# Altium project Load_Bank_Master.PrjPcb
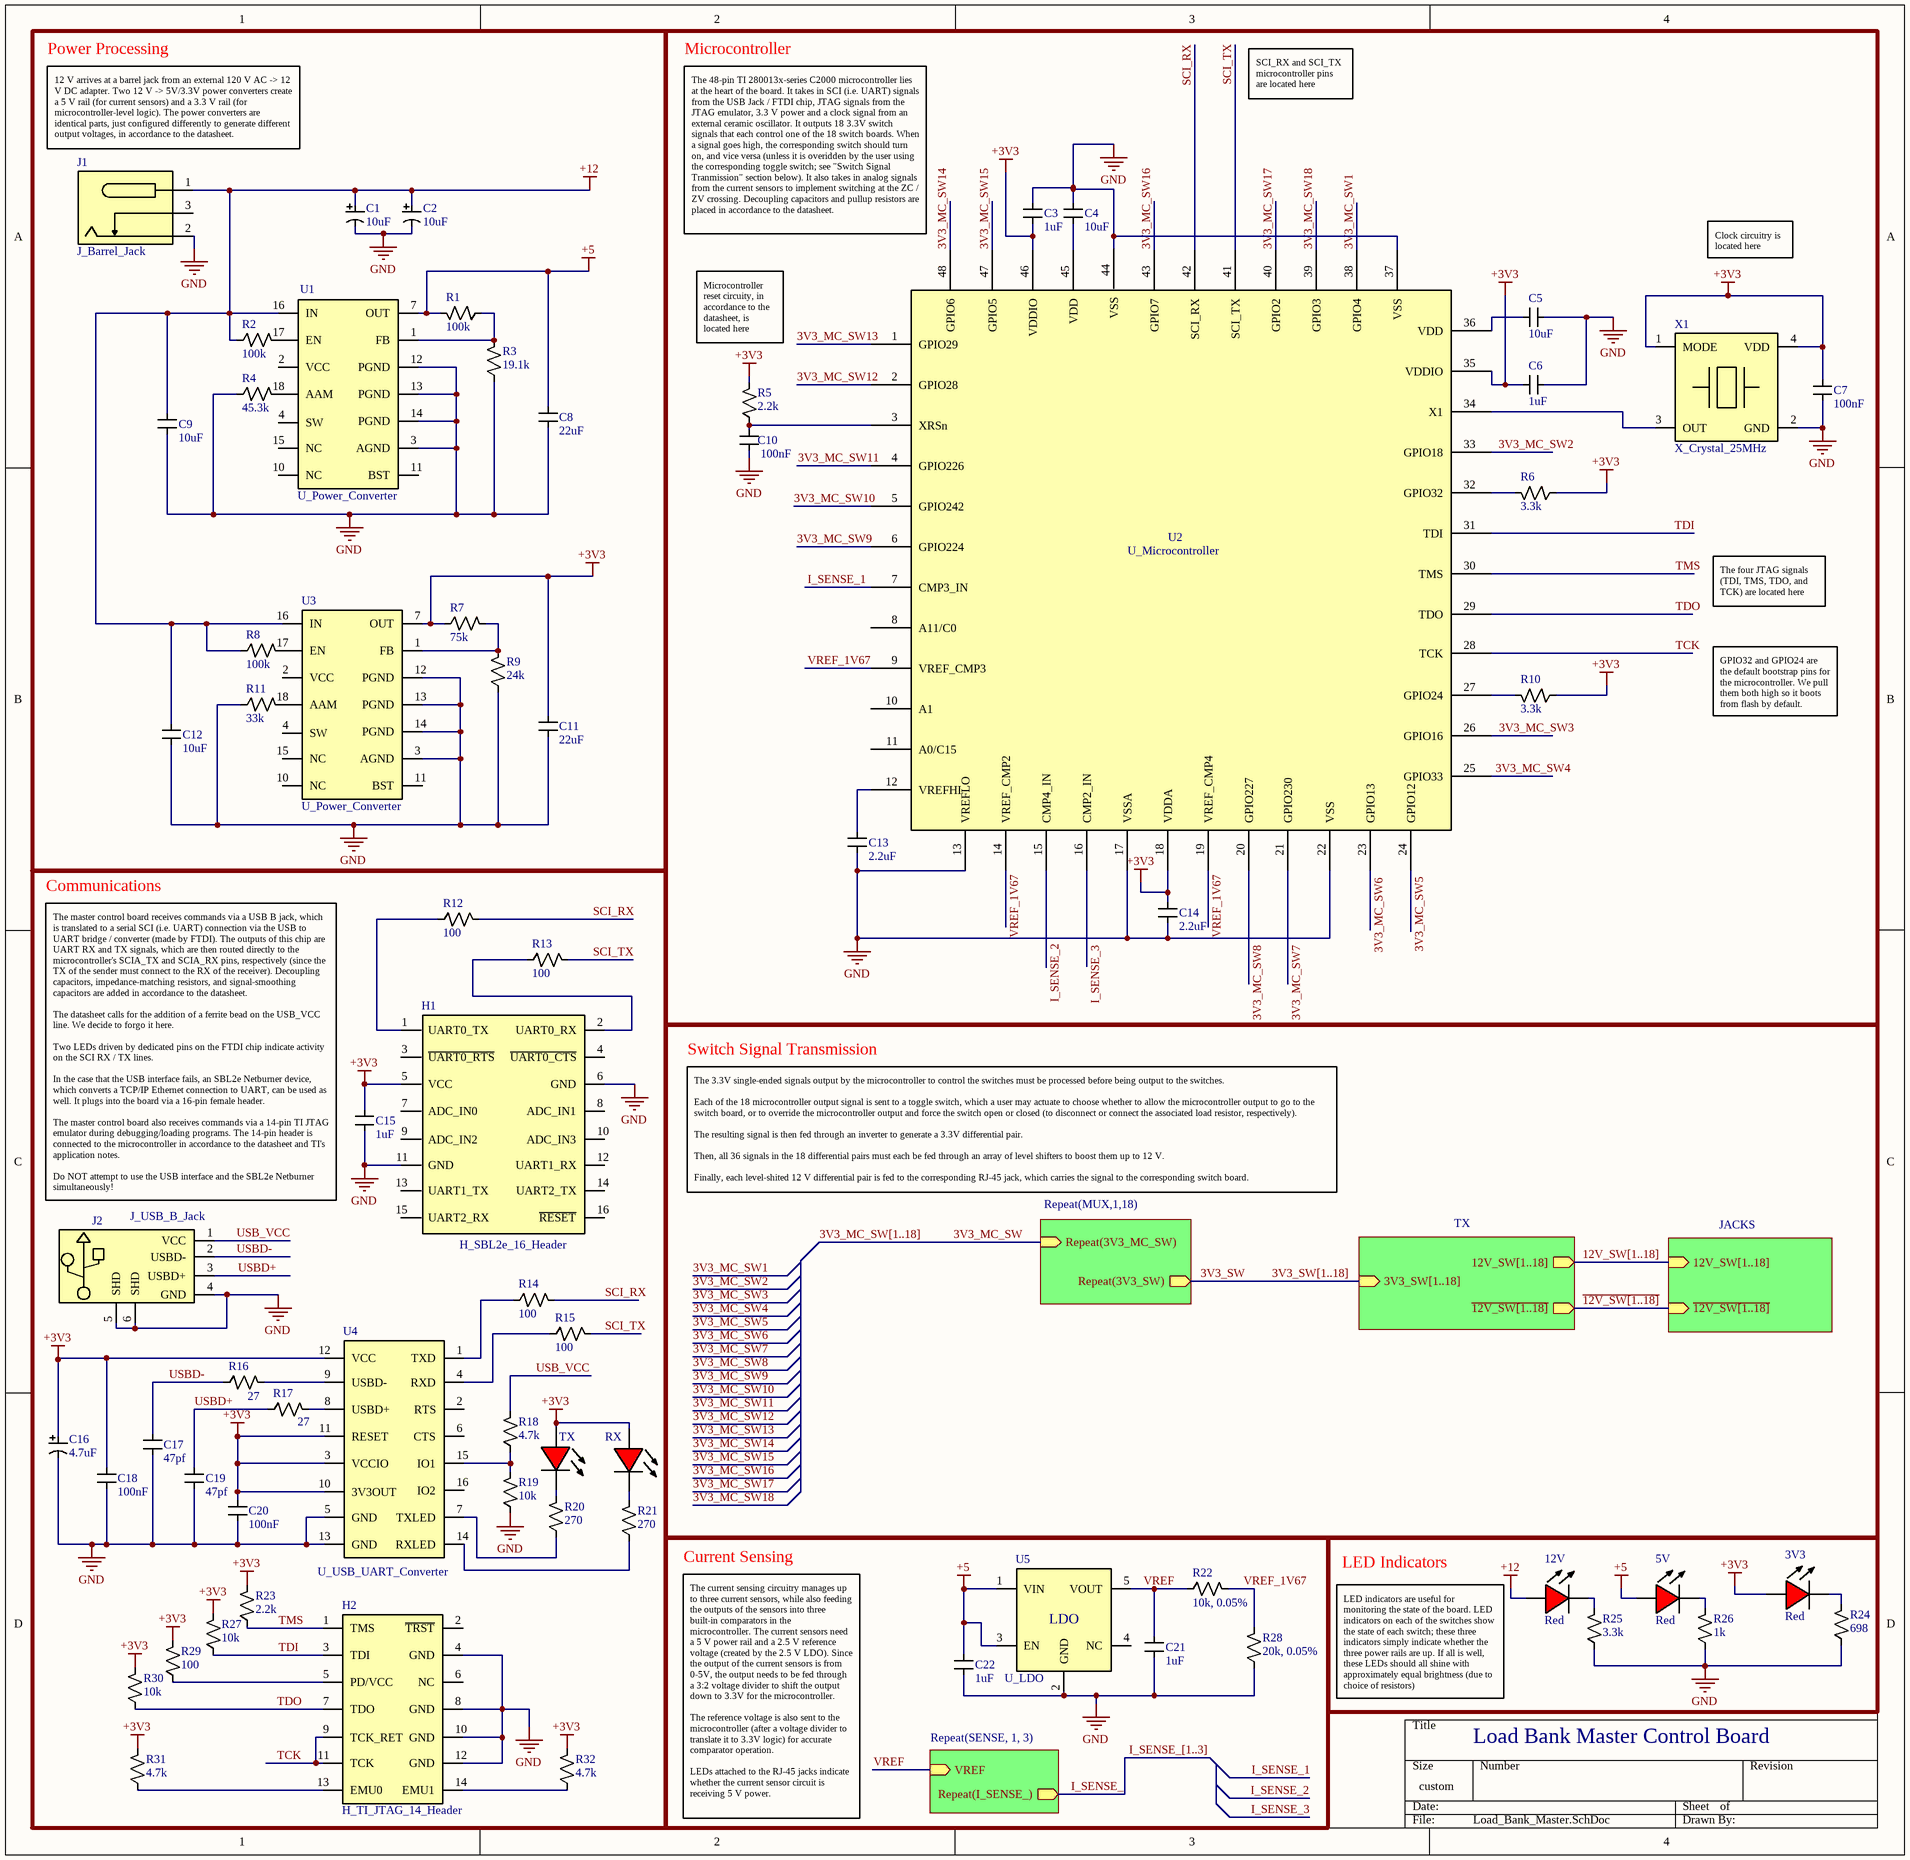
[diagram p0: Load_Bank_Master.SchDoc]
7 sheets, 225 parts. Net scope: hierarchical (ports join the sheet entries above them; power ports are global).
Board file: Load_Bank_Master.PcbDoc
Sheets:
  Load_Bank_Master.SchDoc
    SENSE1 = Current_Sense.SchDoc
    SENSE2 = Current_Sense.SchDoc
    SENSE3 = Current_Sense.SchDoc
    TX = TX.SchDoc
      TX_GROUP1 = TX_GROUP.SchDoc
      TX_GROUP2 = TX_GROUP.SchDoc
      TX_GROUP3 = TX_GROUP.SchDoc
    MUX1 = MUX.SchDoc
    MUX2 = MUX.SchDoc
    MUX3 = MUX.SchDoc
    MUX4 = MUX.SchDoc
    MUX5 = MUX.SchDoc
    MUX6 = MUX.SchDoc
    MUX7 = MUX.SchDoc
    MUX8 = MUX.SchDoc
    MUX9 = MUX.SchDoc
    MUX10 = MUX.SchDoc
    MUX11 = MUX.SchDoc
    MUX12 = MUX.SchDoc
    MUX13 = MUX.SchDoc
    MUX14 = MUX.SchDoc
    MUX15 = MUX.SchDoc
    MUX16 = MUX.SchDoc
    MUX17 = MUX.SchDoc
    MUX18 = MUX.SchDoc
    JACKS = Jacks.SchDoc
      JACK1 = Jack.SchDoc
      JACK2 = Jack.SchDoc
      JACK3 = Jack.SchDoc
      JACK4 = Jack.SchDoc
      JACK5 = Jack.SchDoc
      JACK6 = Jack.SchDoc
      JACK7 = Jack.SchDoc
      JACK8 = Jack.SchDoc
      JACK9 = Jack.SchDoc

## Sheet Load_Bank_Master.SchDoc
size 357 x 347 mm; SheetNumber: 1; SheetTotal: 7

### Parts
3V3  Red  [0603_LED]
5V  Red  [0603_LED]
12V  Red  [0603_LED]
C1  10uF  [ALUM_CAP]
C2  10uF  [ALUM_CAP]
C3  1uF  [0603_CAP]
C4  10uF  [0805_CAP]
C5  10uF  [0805_CAP]
C6  1uF  [0603_CAP]
C7  100nF  [0603_CAP]
C8  22uF  [1206_CAP]
C9  10uF  [0805_CAP]
C10  100nF  [0603_CAP]
C11  22uF  [1206_CAP]
C12  10uF  [0805_CAP]
C13  2.2uF  [0603_CAP]
C14  2.2uF  [0603_CAP]
C15  1uF  [0603_CAP]
C16  4.7uF  [ALUM_CAP]
C17  47pf  [0603_CAP]
C18  100nF  [0603_CAP]
C19  47pf  [0603_CAP]
C20  100nF  [0603_CAP]
C21  1uF  [0603_CAP]
C22  1uF  [0603_CAP]
H1  H_SBL2e_16_Header  [16PIN_HEADER]
H2  H_TI_JTAG_14_Header  [14PIN_HEADER]
J1  J_Barrel_Jack  [PWR_JACK]
J2  J_USB_B_Jack  [USB_B_JACK]
R1  100k  [0603_RES]
R2  100k  [0603_RES]
R3  19.1k  [0603_RES]
R4  45.3k  [0603_RES]
R5  2.2k  [0603_RES]
R6  3.3k  [0603_RES]
R7  75k  [0603_RES]
R8  100k  [0603_RES]
R9  24k  [0603_RES]
R10  3.3k  [0603_RES]
R11  33k  [0603_RES]
R12  100  [0603_RES]
R13  100  [0603_RES]
R14  100  [0603_RES]
R15  100  [0603_RES]
R16  27  [0603_RES]
R17  27  [0603_RES]
R18  4.7k  [0603_RES]
R19  10k  [0603_RES]
R20  270  [0603_RES]
R21  270  [0603_RES]
R22  10k, 0.05%  [0603_RES]
R23  2.2k  [0603_RES]
R24  698  [0603_RES]
R25  3.3k  [0603_RES]
R26  1k  [0603_RES]
R27  10k  [0603_RES]
R28  20k, 0.05%  [0603_RES]
R29  100  [0603_RES]
R30  10k  [0603_RES]
R31  4.7k  [0603_RES]
R32  4.7k  [0603_RES]
RX  Red  [0603_LED]  (value not drawn)
TX  Red  [0603_LED]  (value not drawn)
U1  U_Power_Converter  [PWR_CONVERTER]
U2  U_Microcontroller  [MICROCONTROLLER]
U3  U_Power_Converter  [PWR_CONVERTER]
U4  U_USB_UART_Converter  [TSSOP-16]
U5  U_LDO  [SOT25]
X1  X_Crystal_25MHz  [CRYSTAL]

### Blocks framed on the sheet
Power Processing: C1 C2 C8 C9 C11 C12 J1 R1-R4 R7-R9 R11 U1 U3
Microcontroller: C3-C7 C10 C13 C14 R5 R6 R10 U2 X1
Communications: C15-C20 H1 H2 J2 R12-R21 R23 R27 R29-R32 RX TX U4
Current Sensing: C21 C22 R22 R28 U5
LED Indicators: 3V3 5V 12V R24-R26

### Sub-sheets
JACKS = Jacks.SchDoc: 12V_SW[1..18] (in), ~{12V_SW[1..18]} (in)
Repeat(MUX,1,18) = MUX.SchDoc: Repeat(3V3_MC_SW) (in), Repeat(3V3_SW) (out)
Repeat(SENSE, 1, 3) = Current_Sense.SchDoc: Repeat(I_SENSE_) (out), VREF (in)
TX = TX.SchDoc: 3V3_SW[1..18] (in), 12V_SW[1..18] (out), ~{12V_SW[1..18]} (out)

### Nets
+3V3: 3V3.2 C3.1 C6.1 C7.2 C11.2 C14.2 C15.2 C16.2 C18.2 C20.2 H1.5(VCC) R5.2 R6.1 R7.1 R10.1 R23.2 R27.2 R29.2 R30.2 R31.2 R32.2 RX.2 TX.2 U2.18(VDDA) U2.35(VDDIO) U2.46(VDDIO) U3.7(OUT) U4.3(VCCIO) U4.10(3V3OUT) U4.11(RESET) U4.12(VCC) X1.1(MODE) X1.4(VDD)
+5: 5V.2 C8.2 C22.2 R1.2 U1.7(OUT) U5.1(VIN) U5.3(EN)
+12: 12V.2 C1.2 C2.2 C9.2 C12.2 J1.1(GND) R2.1 R8.1 U1.16(IN) U3.16(IN)
GND: C1.1 C2.1 C3.2 C4.2 C5.2 C6.2 C7.1 C8.1 C9.1 C10.1 C11.1 C12.1 C13.1 C14.1 C15.1 C16.1 C17.1 C18.1 C19.1 C20.1 C21.1 C22.1 H1.6(GND) H1.11(GND) H2.4(GND) H2.8(GND) H2.10(GND) H2.12(GND) J1.2(PWR_JACK) J2.4(GND) J2.5(SHD) J2.6(SHD) R3.1 R4.1 R9.1 R11.1 R19.1 R24.1 R25.1 R26.1 R28.1 U1.3(AGND) U1.12(PGND) U1.13(PGND) U1.14(PGND) U2.13(VREFLO) U2.17(VSSA) U2.22(VSS) U2.37(VSS) U2.44(VSS) U3.3(AGND) U3.12(PGND) U3.13(PGND) U3.14(PGND) U4.5(GND) U4.13(GND) U5.2(GND) X1.2(GND)
3V3_MC_SW: sheet Repeat(MUX,1,18)/Repeat(3V3_MC_SW)
3V3_MC_SW1: U2.38(GPIO4)
3V3_MC_SW2: U2.33(GPIO18)
3V3_MC_SW3: U2.26(GPIO16)
3V3_MC_SW4: U2.25(GPIO33)
3V3_MC_SW5: U2.24(GPIO12)
3V3_MC_SW6: U2.23(GPIO13)
3V3_MC_SW7: U2.21(GPIO230)
3V3_MC_SW8: U2.20(GPIO227)
3V3_MC_SW9: U2.6(GPIO224)
3V3_MC_SW10: U2.5(GPIO242)
3V3_MC_SW11: U2.4(GPIO226)
3V3_MC_SW12: U2.2(GPIO28)
3V3_MC_SW13: U2.1(GPIO29)
3V3_MC_SW14: U2.48(GPIO6)
3V3_MC_SW15: U2.47(GPIO5)
3V3_MC_SW16: U2.43(GPIO7)
3V3_MC_SW17: U2.40(GPIO2)
3V3_MC_SW18: U2.39(GPIO3)
3V3_SW: sheet Repeat(MUX,1,18)/Repeat(3V3_SW)
I_SENSE_: sheet Repeat(SENSE, 1, 3)/Repeat(I_SENSE_)
I_SENSE_1: U2.7(CMP3_IN)
I_SENSE_2: U2.15(CMP4_IN)
I_SENSE_3: U2.16(CMP2_IN)
SCI_RX: R12.2 R14.2 U2.42(SCI_RX)
SCI_TX: R13.2 R15.2 U2.41(SCI_TX)
TCK: H2.9(TCK_RET) H2.11(TCK) U2.28(TCK)
TDI: H2.3(TDI) R27.1 U2.31(TDI)
TDO: H2.7(TDO) R30.1 U2.29(TDO)
TMS: H2.1(TMS) R23.1 U2.30(TMS)
USB_VCC: J2.1(VCC) R18.2
USBD+: C19.2 J2.3(USBD+) R17.1
USBD-: C17.2 J2.2(USBD-) R16.1
VREF: C21.2 R22.1 U5.5(VOUT) ; sheet Repeat(SENSE, 1, 3)/VREF
VREF_1V67: R22.2 R28.2 U2.9(VREF_CMP3) U2.14(VREF_CMP2) U2.19(VREF_CMP4)
Net3V3_1: 3V3.1 R24.2
Net5V_1: 5V.1 R26.2
Net12V_1: 12V.1 R25.2
NetC4_1: C4.1 U2.45(VDD)
NetC5_1: C5.1 U2.36(VDD)
NetC10_2: C10.2 R5.1 U2.3(XRSn)
NetC13_2: C13.2 U2.12(VREFHI)
NetH1_1: H1.1(UART0_TX) R12.1
NetH1_2: H1.2(UART0_RX) R13.1
NetH2_5: H2.5(PD/VCC) R29.1
NetH2_13: H2.13(EMU0) R31.1
NetH2_14: H2.14(EMU1) R32.1
NetR1_1: R1.1 R3.2 U1.1(FB)
NetR2_2: R2.2 U1.17(EN)
NetR4_2: R4.2 U1.18(AAM)
NetR6_2: R6.2 U2.32(GPIO32)
NetR7_2: R7.2 R9.2 U3.1(FB)
NetR8_2: R8.2 U3.17(EN)
NetR10_2: R10.2 U2.27(GPIO24)
NetR11_2: R11.2 U3.18(AAM)
NetR14_1: R14.1 U4.1(TXD)
NetR15_1: R15.1 U4.4(RXD)
NetR16_2: R16.2 U4.9(USBD-)
NetR17_2: R17.2 U4.8(USBD+)
NetR18_1: R18.1 R19.2 U4.15(IO1)
NetR20_1: R20.1 U4.7(TXLED)
NetR20_2: R20.2 TX.1
NetR21_1: R21.1 U4.14(RXLED)
NetR21_2: R21.2 RX.1
NetU2_34: U2.34(X1) X1.3(OUT)

Not connected (* = marked no-connect by the designer): H1 3(~{UART0_RTS}) 4(~{UART0_CTS}) 7(ADC_IN0) 8(ADC_IN1) 9(ADC_IN2) 10(ADC_IN3) 12(UART1_RX) 13(UART1_TX) 14(UART2_TX) 15(UART2_RX) 16(~{RESET}); H2 2(~{TRST}) 6(NC); J1 3(PWR_BAT); U1 2(VCC) 4(SW) 10(NC) 11(BST) 15(NC); U2 8(A11/C0) 10(A1) 11(A0/C15); U3 2(VCC) 4(SW) 10(NC) 11(BST) 15(NC); U4 2(RTS) 6(CTS) 16(IO2); U5 4(NC)

### Buses and harness runs
bus 3V3_MC_SW[1..18]
bus 3V3_SW[1..18] = sheet TX/3V3_SW[1..18]
bus 12V_SW[1..18] = sheet JACKS/12V_SW[1..18] = sheet TX/12V_SW[1..18]
bus I_SENSE_[1..3]
bus ~{12V_SW[1..18]} = sheet JACKS/~{12V_SW[1..18]} = sheet TX/~{12V_SW[1..18]}

### Notes on the sheet
- SCI_RX and SCI_TX microcontroller pins are located here
- (near J1) 12 V arrives at a barrel jack from an external 120 V AC -> 12 V DC adapter. Two 12 V -> 5V/3.3V power converters create a 5 V rail (for current sensors) and a 3.3 V rail (for microcontroller-level logic). The power converters are identical parts, just configured differently to generate different output voltages, in accordance to the datasheet.
- The 48-pin TI 280013x-series C2000 microcontroller lies at the heart of the board. It takes in SCI (i.e. UART) signals from the USB Jack / FTDI chip, JTAG signals from the JTAG emulator, 3.3 V power and a clock signal from an external ceramic oscillator. It outputs 18 3.3V switch signals that each control one of the 18 switch boards. When a signal goes high, the corresponding switch should turn on, and vice versa (unless it is overidden by the user using the corresponding toggle switch; see "Switch Signal Tranmission" section below). It also takes in analog signals from the current sensors to implement switching at the ZC / ZV crossing. Decoupling capacitors and pullup resistors are placed in accordance to the datasheet.
- Clock circuitry is located here
- (near R5) Microcontroller reset circuity, in accordance to the datasheet, is located here
- The four JTAG signals (TDI, TMS, TDO, and TCK) are located here
- GPIO32 and GPIO24 are the default bootstrap pins for the microcontroller. We pull them both high so it boots from flash by default.
- Switch Signal Transmission
- The master control board receives commands via a USB B jack, which is translated to a serial SCI (i.e. UART) connection via the USB to UART bridge / converter (made by FTDI). The outputs of this chip are UART RX and TX signals, which are then routed directly to the microcontroller's SCIA_TX and SCIA_RX pins, respectively (since the TX of the sender must connect to the RX of the receiver). Decoupling capacitors, impedance-matching resistors, and signal-smoothing capacitors are added in accordance to the datasheet.
  The datasheet calls for the addition of a ferrite bead on the USB_VCC line. We decide to forgo it here.
  Two LEDs driven by dedicated pins on the FTDI chip indicate activity on the SCI RX / TX lines.
  In the case that the USB interface fails, an SBL2e Netburner device, which converts a TCP/IP Ethernet connection to UART, can be used as well. It plugs into the board via a 16-pin female header.
  The master control board also receives commands via a 14-pin TI JTAG emulator during debugging/loading programs. The 14-pin header is connected to the microcontroller in accordance to the datasheet and TI's application notes.
  Do NOT attempt to use the USB interface and the SBL2e Netburner simultaneously!
- The 3.3V single-ended signals output by the microcontroller to control the switches must be processed before being output to the switches.
  Each of the 18 microcontroller output signal is sent to a toggle switch, which a user may actuate to choose whether to allow the microcontroller output to go to the switch board, or to override the microcontroller output and force the switch open or closed (to disconnect or connect the associated load resistor, respectively).
  The resulting signal is then fed through an inverter to generate a 3.3V differential pair.
  Then, all 36 signals in the 18 differential pairs must each be fed through an array of level shifters to boost them up to 12 V.
  Finally, each level-shited 12 V differential pair is fed to the corresponding RJ-45 jack, which carries the signal to the corresponding switch board.
- (near 12V) LED indicators are useful for monitoring the state of the board. LED indicators on each of the switches show the state of each switch; these three indicators simply indicate whether the three power rails are up. If all is well, these LEDs should all shine with approximately equal brightness (due to choice of resistors)
- Load Bank Master Control Board
- The current sensing circuitry manages up to three current sensors, while also feeding the outputs of the sensors into three built-in comparators in the microcontroller. The current sensors need a 5 V power rail and a 2.5 V reference voltage (created by the 2.5 V LDO). Since the output of the current sensors is from 0-5V, the output needs to be fed through a 3:2 voltage divider to shift the output down to 3.3V for the microcontroller.
  The reference voltage is also sent to the microcontroller (after a voltage divider to translate it to 3.3V logic) for accurate comparator operation.
  LEDs attached to the RJ-45 jacks indicate whether the current sensor circuit is receiving 5 V power.
- (in symbol U_LDO) LDO

### Library data of the parts
3V3 5V 12V RX TX = LED_0603_Red: LED SMD 0603 Red
C1 C2 = C_10uF_AlElec: Capacitor SMD Aluminum Electrolytic 10 uF
C3 C6 C15 C21 C22 = C_1uF_0603: Capacitor SMD MLCC 1 uF 0603 25 V
C4 C5 C9 C12 = C_10uF_0805: Capacitor SMD MLCC 10 uF 0805
C7 C10 C18 C20 = C_100nF_0603: Capacitor SMD MLCC 100 nF 0603
C8 C11 = C_22uF_1206: Capacitor SMD MLCC 22 uF 25 V 1206
C13 C14 = C_2.2uF_0603: Capacitor SMD MLCC 2.2 uF 0603
C16 = C_4.7uF_AlElec: Capacitor SMD Aluminum Electrolytic 4.7 uF
C17 C19 = C_47pF_0603: Capacitor SMD MLCC 47 pF 0603
H1 = H_SBL2e_16_Header: 16-pin SBL2e Netburner Header
H2 = H_TI_JTAG_14_Header: 14-pin TI JTAG Header
J1 = J_Barrel_Jack: Jack 12 V Barrel Jack Power Plug
J2 = J_USB_B_Jack: Jack USB Type B
R1 R2 R8 = R_100kOhm_0603_0.5%: Resistor 100 kOhm 0603 0.5%
R3 = R_19.1kOhm_0603_0.5%: Resistor 19.1 kOhm 0603 0.5%
R4 = R_45.3kOhm_0603_0.5%: Resistor 45.3 kOhm 0603 0.5%
R5 R23 = R_2.2kOhm_0603_0.5%: Resistor 2.2 kOhm 0603 0.5%
R6 R10 R25 = R_3300Ohm_0603_1%: Resistor 3.3 kOhm 0603 1%
R7 = R_75kOhm_0603_0.5%: Resistor 75 kOhm 0603 0.5%
R9 = R_24kOhm_0603_0.5%: Resistor 24 kOhm 0603 0.5%
R11 = R_33kOhm_0603_0.5%: Resistor 33 kOhm 0603 0.5%
R12-R15 R29 = R_100Ohm_0603_0.5%: Resistor 100 Ohm 0603 0.5%
R16 R17 = R_27Ohm_0603_1%: Resistor 27 Ohm 0603 1%
R18 R31 R32 = R_4.7kOhm_0603_0.5%_1: Resistor 4.7k kOhm 0603 0.5%
R19 R27 R30 = R_10kOhm_0603_0.5%: Resistor 10 kOhm 0603 0.5%
R20 R21 = R_270Ohm_0603_1%: Resistor 270 Ohm 0603 1%
R22 = R_10kOhm_0603_0.05%: Resistor 10 kOhm 0603 0.05%
R24 = R_698Ohm_0603_0.5%: Resistor 698 Ohm 0603 0.5%
R26 = R_1kOhm_0603_0.5%: Resistor 1 kOhm 0603 0.5%
R28 = R_20kOhm_0603_0.05%: Resistor 20 kOhm 0603 0.05%
U1 U3 = U_Power_Converter: IC 12 V to 5V/3.3V switching power converter
U2 = U_Microcontroller: IC TI C2000 Microcontroller, 48-pin LQFP
U4 = U_USB_UART_Converter: FTDI USB to UART Converter TSSOP-16 FT230-XS
U5 = U_LDO: IC 2.5 V LDO
X1 = X_Crystal_25MHz: Crystal Oscillator 25 MHz 3.3 V

## Sheet Current_Sense.SchDoc
size 127 x 101 mm; SheetNumber: 2; SheetTotal: 7
Used 3 times, as channels SENSE1, SENSE2, SENSE3. Parts and nets are listed once, with the designators drawn on the sheet.
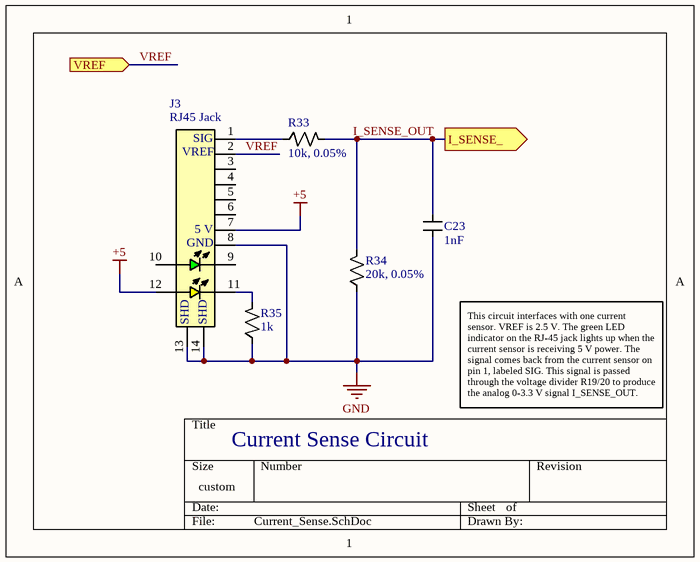
[diagram p1: Current_Sense.SchDoc]

### Parts
C23  1nF  [0603_CAP]
J3  RJ45 Jack  [RJ45_JACK]
R33  10k, 0.05%  [0603_RES]
R34  20k, 0.05%  [0603_RES]
R35  1k  [0603_RES]

### Ports
I_SENSE_ (out, see Load_Bank_Master[3D]), VREF (in, see Load_Bank_Master[2D])

### Nets
+5: J3.7(12_V) J3.12
GND: C23.1 J3.8(GND) J3.13(SHD1) J3.14(SHD2) R34.1 R35.1
I_SENSE_OUT: C23.2 R33.2 R34.2 ; port I_SENSE_
VREF: J3.2(VREF) ; port VREF
NetJ3_1: J3.1(Sig1) R33.1
NetJ3_11: J3.11 R35.2

Not connected (* = marked no-connect by the designer): J3 3(NC) 4(NC) 5(NC) 6(NC) 9(__) 10(__)

### Channels
SENSE1: designators end in _SENSE1; ports I_SENSE_=I_SENSE_1 VREF=VREF
SENSE2: designators end in _SENSE2; ports I_SENSE_=I_SENSE_2 VREF=VREF
SENSE3: designators end in _SENSE3; ports I_SENSE_=I_SENSE_3 VREF=VREF

### Notes on the sheet
- Current Sense Circuit
- This circuit interfaces with one current sensor. VREF is 2.5 V. The green LED indicator on the RJ-45 jack lights up when the current sensor is receiving 5 V power. The signal comes back from the current sensor on pin 1, labeled SIG. This signal is passed through the voltage divider R19/20 to produce the analog 0-3.3 V signal I_SENSE_OUT.
- (in symbol J_RJ45_Jack_Sense) SIG; 5 V; SHD

### Library data of the parts
C23 = C_1nF_0603: Capacitor SMD MLCC 1 nF 0603
J3 = J_RJ45_Jack_Sense: Jack RJ-45 8-pin (for current sensing)
R33 = R_10kOhm_0603_0.05%: Resistor 10 kOhm 0603 0.05%
R34 = R_20kOhm_0603_0.05%: Resistor 20 kOhm 0603 0.05%
R35 = R_1kOhm_0603_0.5%: Resistor 1 kOhm 0603 0.5%

## Sheet TX.SchDoc
size A; SheetNumber: 3; SheetTotal: 7
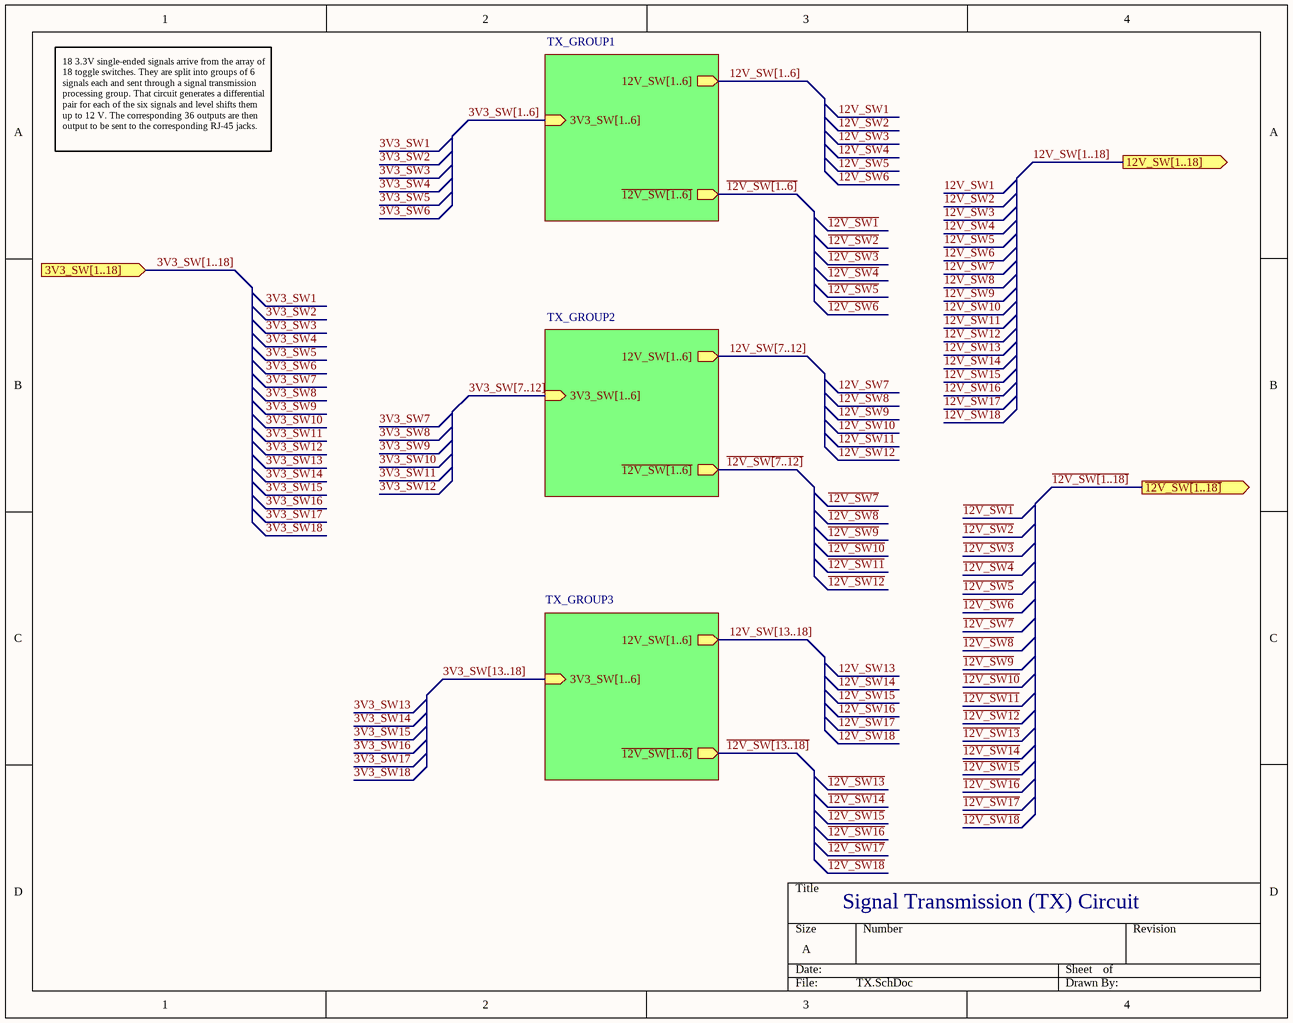
[diagram p2: TX.SchDoc]

### Sub-sheets
TX_GROUP1 = TX_GROUP.SchDoc: 3V3_SW[1..6] (in), ~{12V_SW[1..6]} (out), 12V_SW[1..6] (out)
TX_GROUP2 = TX_GROUP.SchDoc: 3V3_SW[1..6] (in), ~{12V_SW[1..6]} (out), 12V_SW[1..6] (out)
TX_GROUP3 = TX_GROUP.SchDoc: 3V3_SW[1..6] (in), ~{12V_SW[1..6]} (out), 12V_SW[1..6] (out)

### Ports
3V3_SW[1..18] (in, see Load_Bank_Master[3C], TX_GROUP[1A]), 12V_SW[1..18] (out, see Load_Bank_Master[4C], Jacks[1A], TX_GROUP[4B]), ~{12V_SW[1..18]} (out, see Load_Bank_Master[4C], Jacks[1B], TX_GROUP[4A])

### Buses and harness runs
bus 3V3_SW[1..6] = sheet TX_GROUP1/3V3_SW[1..6]
bus 3V3_SW[1..18] = port 3V3_SW[1..18]
bus 3V3_SW[7..12] = sheet TX_GROUP2/3V3_SW[1..6]
bus 3V3_SW[13..18] = sheet TX_GROUP3/3V3_SW[1..6]
bus 12V_SW[1..6] = sheet TX_GROUP1/12V_SW[1..6]
bus 12V_SW[1..18] = port 12V_SW[1..18]
bus 12V_SW[7..12] = sheet TX_GROUP2/12V_SW[1..6]
bus 12V_SW[13..18] = sheet TX_GROUP3/12V_SW[1..6]
bus ~{12V_SW[1..6]} = sheet TX_GROUP1/~{12V_SW[1..6]}
bus ~{12V_SW[1..18]} = port ~{12V_SW[1..18]}
bus ~{12V_SW[7..12]} = sheet TX_GROUP2/~{12V_SW[1..6]}
bus ~{12V_SW[13..18]} = sheet TX_GROUP3/~{12V_SW[1..6]}

### Notes on the sheet
- 18 3.3V single-ended signals arrive from the array of 18 toggle switches. They are split into groups of 6 signals each and sent through a signal transmission processing group. That circuit generates a differential pair for each of the six signals and level shifts them up to 12 V. The corresponding 36 outputs are then output to be sent to the corresponding RJ-45 jacks.
- Signal Transmission (TX) Circuit

## Sheet TX_GROUP.SchDoc
size A; SheetNumber: 4; SheetTotal: 7
Used 3 times, as channels TX/TX_GROUP1, TX/TX_GROUP2, TX/TX_GROUP3. Parts and nets are listed once, with the designators drawn on the sheet.
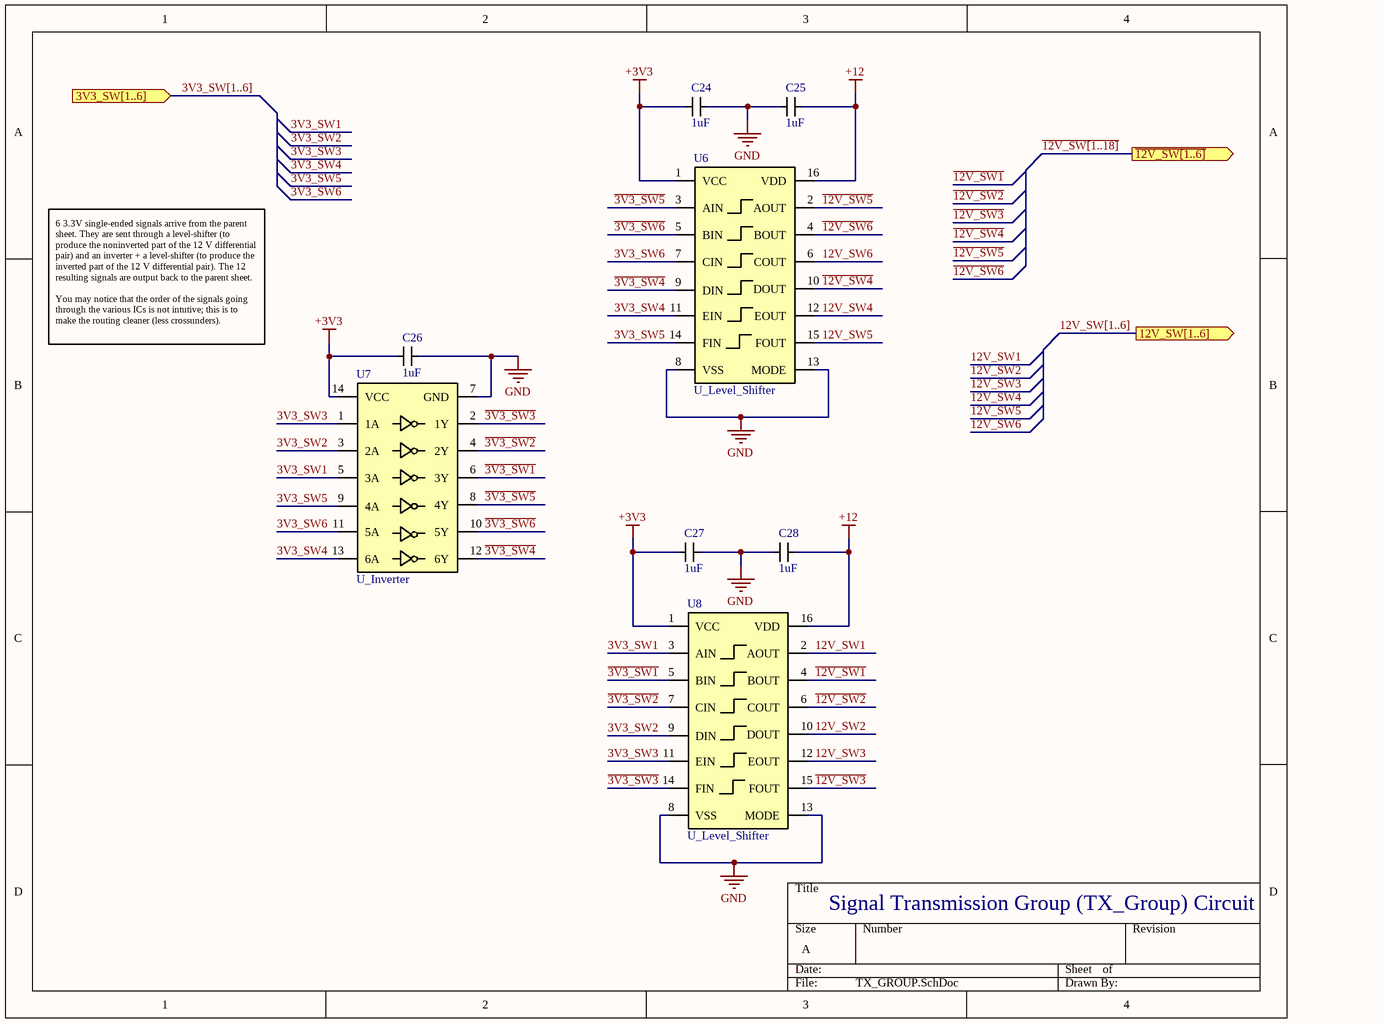
[diagram p3: TX_GROUP.SchDoc]

### Parts
C24  1uF  [0603_CAP]
C25  1uF  [0603_CAP]
C26  1uF  [0603_CAP]
C27  1uF  [0603_CAP]
C28  1uF  [0603_CAP]
U6  U_Level_Shifter  [TSSOP-16]
U7  U_Inverter  [INVERTER]
U8  U_Level_Shifter  [TSSOP-16]

### Ports
3V3_SW[1..6] (in, see TX[2A], TX[1B]), 12V_SW[1..6] (out, see TX[3A], Jacks[1A], TX[4A]), ~{12V_SW[1..6]} (out, see TX[3A], Jacks[1C], TX[4B])

### Nets
+3V3: C24.1 C26.1 C27.1 U6.1(VCC) U7.14(VCC) U8.1(VCC)
+12: C25.2 C28.2 U6.16(VDD) U8.16(VDD)
GND: C24.2 C25.1 C26.2 C27.2 C28.1 U6.8(VSS) U6.13(MODE) U7.7(GND) U8.8(VSS) U8.13(MODE)
3V3_SW1: U7.5(3A) U8.3(AIN)
3V3_SW2: U7.3(2A) U8.9(DIN)
3V3_SW3: U7.1(1A) U8.11(EIN)
3V3_SW4: U6.11(EIN) U7.13(6A)
3V3_SW5: U6.14(FIN) U7.9(4A)
3V3_SW6: U6.7(CIN) U7.11(5A)
12V_SW1: U8.2(AOUT)
12V_SW2: U8.10(DOUT)
12V_SW3: U8.12(EOUT)
12V_SW4: U6.12(EOUT)
12V_SW5: U6.15(FOUT)
12V_SW6: U6.6(COUT)
~{3V3_SW1}: U7.6(3Y) U8.5(BIN)
~{3V3_SW2}: U7.4(2Y) U8.7(CIN)
~{3V3_SW3}: U7.2(1Y) U8.14(FIN)
~{3V3_SW4}: U6.9(DIN) U7.12(6Y)
~{3V3_SW5}: U6.3(AIN) U7.8(4Y)
~{3V3_SW6}: U6.5(BIN) U7.10(5Y)
~{12V_SW1}: U8.4(BOUT)
~{12V_SW2}: U8.6(COUT)
~{12V_SW3}: U8.15(FOUT)
~{12V_SW4}: U6.10(DOUT)
~{12V_SW5}: U6.2(AOUT)
~{12V_SW6}: U6.4(BOUT)

### Channels
TX/TX_GROUP1: designators end in _TX_GROUP1
TX/TX_GROUP2: designators end in _TX_GROUP2
TX/TX_GROUP3: designators end in _TX_GROUP3

### Buses and harness runs
bus 3V3_SW[1..6] = port 3V3_SW[1..6]
bus 12V_SW[1..6] = port 12V_SW[1..6]
bus ~{12V_SW[1..18]} = port ~{12V_SW[1..6]}

### Notes on the sheet
- 6 3.3V single-ended signals arrive from the parent sheet. They are sent through a level-shifter (to produce the noninverted part of the 12 V differential pair) and an inverter + a level-shifter (to produce the inverted part of the 12 V differential pair). The 12 resulting signals are output back to the parent sheet.
  You may notice that the order of the signals going through the various ICs is not intutive; this is to make the routing cleaner (less crossunders).
- Signal Transmission Group (TX_Group) Circuit

### Library data of the parts
C24-C28 = C_1uF_0603: Capacitor SMD MLCC 1 uF 0603 25 V
U6 U8 = U_Level_Shifter: IC 6-in-1 level shifter
U7 = U_Inverter: IC 6-in-1 inverter

## Sheet MUX.SchDoc
size 101 x 101 mm; SheetNumber: 5; SheetTotal: 7
Used 18 times, as channels MUX1, MUX2, MUX3, MUX4, MUX5, MUX6, MUX7, MUX8, MUX9, MUX10, MUX11, MUX12, MUX13, MUX14, MUX15, MUX16, MUX17, MUX18. Parts and nets are listed once, with the designators drawn on the sheet.
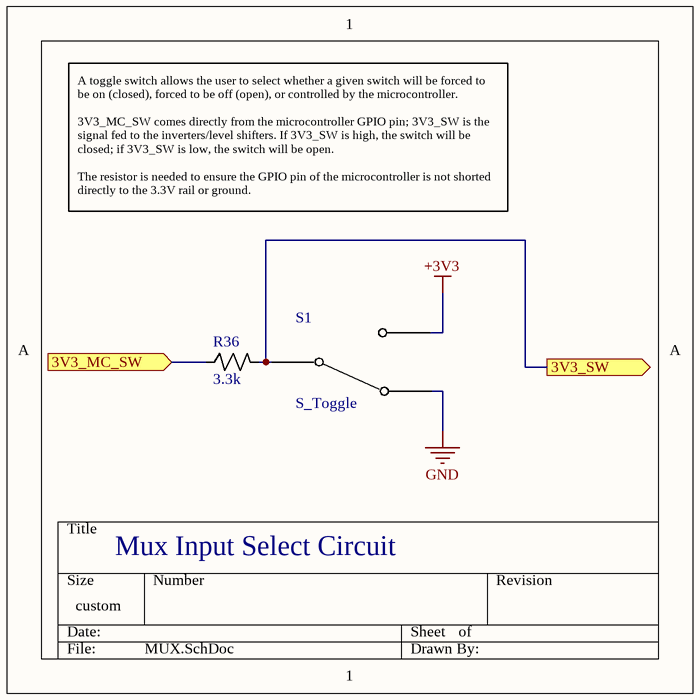
[diagram p4: MUX.SchDoc]

### Parts
R36  3.3k  [0603_RES]
S1  S_Toggle  [TOGGLE]

### Ports
3V3_MC_SW (in, see Load_Bank_Master[3C]), 3V3_SW (out, see Load_Bank_Master[3C])

### Nets
+3V3: S1.3
GND: S1.1
3V3_MC_SW: R36.1 ; port 3V3_MC_SW
3V3_SW: R36.2 S1.2 ; port 3V3_SW

### Channels
MUX1: designators end in _MUX1; ports 3V3_MC_SW=3V3_MC_SW1 3V3_SW=3V3_SW1
MUX2: designators end in _MUX2; ports 3V3_MC_SW=3V3_MC_SW2 3V3_SW=3V3_SW2
MUX3: designators end in _MUX3; ports 3V3_MC_SW=3V3_MC_SW3 3V3_SW=3V3_SW3
MUX4: designators end in _MUX4; ports 3V3_MC_SW=3V3_MC_SW4 3V3_SW=3V3_SW4
MUX5: designators end in _MUX5; ports 3V3_MC_SW=3V3_MC_SW5 3V3_SW=3V3_SW5
MUX6: designators end in _MUX6; ports 3V3_MC_SW=3V3_MC_SW6 3V3_SW=3V3_SW6
MUX7: designators end in _MUX7; ports 3V3_MC_SW=3V3_MC_SW7 3V3_SW=3V3_SW1
MUX8: designators end in _MUX8; ports 3V3_MC_SW=3V3_MC_SW8 3V3_SW=3V3_SW2
MUX9: designators end in _MUX9; ports 3V3_MC_SW=3V3_MC_SW9 3V3_SW=3V3_SW3
MUX10: designators end in _MUX10; ports 3V3_MC_SW=3V3_MC_SW10 3V3_SW=3V3_SW10
MUX11: designators end in _MUX11; ports 3V3_MC_SW=3V3_MC_SW11 3V3_SW=3V3_SW11
MUX12: designators end in _MUX12; ports 3V3_MC_SW=3V3_MC_SW12 3V3_SW=3V3_SW12
MUX13: designators end in _MUX13; ports 3V3_MC_SW=3V3_MC_SW13 3V3_SW=3V3_SW1
MUX14: designators end in _MUX14; ports 3V3_MC_SW=3V3_MC_SW14 3V3_SW=3V3_SW14
MUX15: designators end in _MUX15; ports 3V3_MC_SW=3V3_MC_SW15 3V3_SW=3V3_SW15
MUX16: designators end in _MUX16; ports 3V3_MC_SW=3V3_MC_SW16 3V3_SW=3V3_SW16
MUX17: designators end in _MUX17; ports 3V3_MC_SW=3V3_MC_SW17 3V3_SW=3V3_SW17
MUX18: designators end in _MUX18; ports 3V3_MC_SW=3V3_MC_SW18 3V3_SW=3V3_SW18

### Notes on the sheet
- A toggle switch allows the user to select whether a given switch will be forced to be on (closed), forced to be off (open), or controlled by the microcontroller.
  3V3_MC_SW comes directly from the microcontroller GPIO pin; 3V3_SW is the signal fed to the inverters/level shifters. If 3V3_SW is high, the switch will be closed; if 3V3_SW is low, the switch will be open.
  The resistor is needed to ensure the GPIO pin of the microcontroller is not shorted directly to the 3.3V rail or ground.
- Mux Input Select Circuit

### Library data of the parts
R36 = R_3300Ohm_0603_1%: Resistor 3.3 kOhm 0603 1%
S1 = S_Toggle: Switch Toggle

## Sheet Jacks.SchDoc
size 215 x 165 mm; SheetNumber: 6; SheetTotal: 7
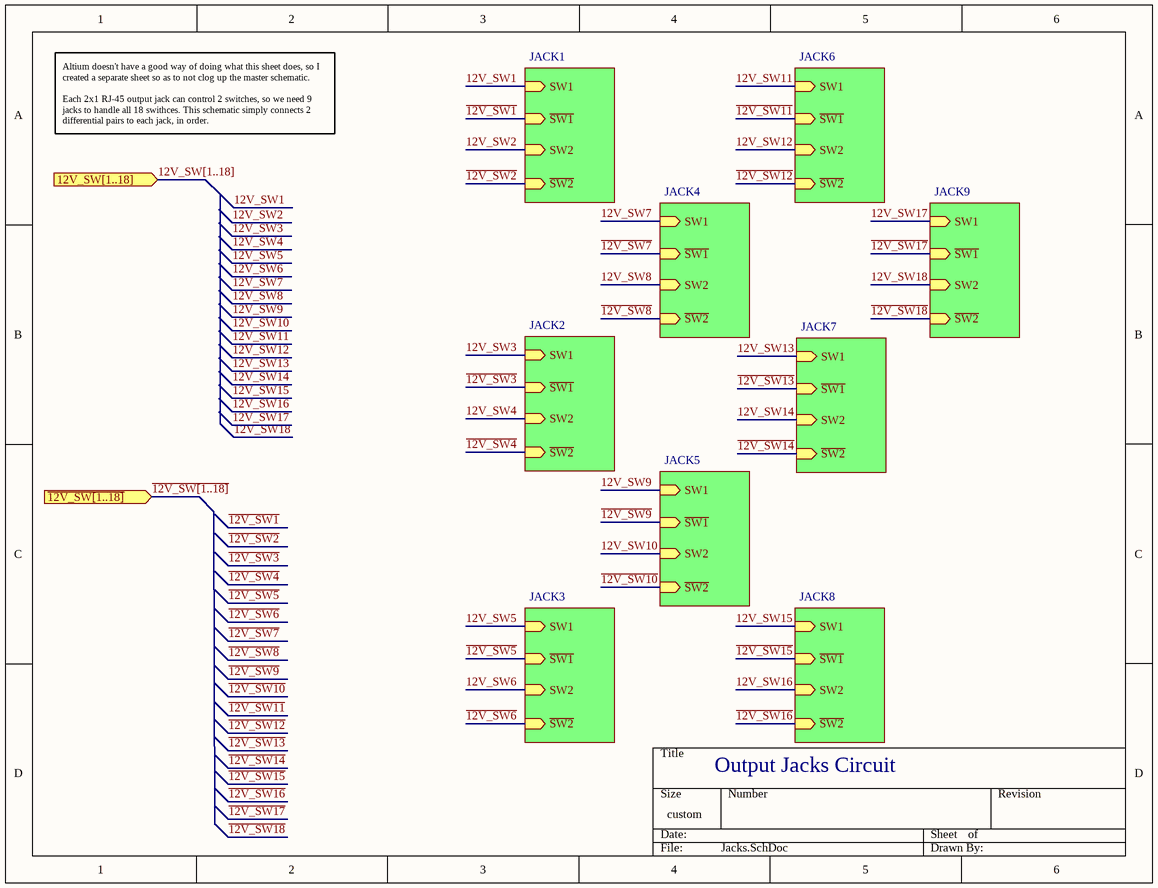
[diagram p5: Jacks.SchDoc]

### Sub-sheets
JACK1 = Jack.SchDoc: SW1 (in), ~{SW1} (in), SW2 (in), ~{SW2} (in)
JACK2 = Jack.SchDoc: SW1 (in), ~{SW1} (in), SW2 (in), ~{SW2} (in)
JACK3 = Jack.SchDoc: SW1 (in), ~{SW1} (in), SW2 (in), ~{SW2} (in)
JACK4 = Jack.SchDoc: SW1 (in), ~{SW1} (in), SW2 (in), ~{SW2} (in)
JACK5 = Jack.SchDoc: SW1 (in), ~{SW1} (in), SW2 (in), ~{SW2} (in)
JACK6 = Jack.SchDoc: SW1 (in), ~{SW1} (in), SW2 (in), ~{SW2} (in)
JACK7 = Jack.SchDoc: SW1 (in), ~{SW1} (in), SW2 (in), ~{SW2} (in)
JACK8 = Jack.SchDoc: SW1 (in), ~{SW1} (in), SW2 (in), ~{SW2} (in)
JACK9 = Jack.SchDoc: SW1 (in), ~{SW1} (in), SW2 (in), ~{SW2} (in)

### Ports
12V_SW[1..18] (in, see Load_Bank_Master[4C], TX[4A], TX_GROUP[4B]), ~{12V_SW[1..18]} (in, see Load_Bank_Master[4C], TX[4B], TX_GROUP[4A])

### Buses and harness runs
bus 12V_SW[1..18] = port 12V_SW[1..18]
bus ~{12V_SW[1..18]} = port ~{12V_SW[1..18]}

### Notes on the sheet
- Altium doesn't have a good way of doing what this sheet does, so I created a separate sheet so as to not clog up the master schematic.
  Each 2x1 RJ-45 output jack can control 2 switches, so we need 9 jacks to handle all 18 swithces. This schematic simply connects 2 differential pairs to each jack, in order.
- Output Jacks Circuit

## Sheet Jack.SchDoc
size 152 x 152 mm; SheetNumber: 7; SheetTotal: 7
Used 9 times, as channels JACKS/JACK1, JACKS/JACK2, JACKS/JACK3, JACKS/JACK4, JACKS/JACK5, JACKS/JACK6, JACKS/JACK7, JACKS/JACK8, JACKS/JACK9. Parts and nets are listed once, with the designators drawn on the sheet.
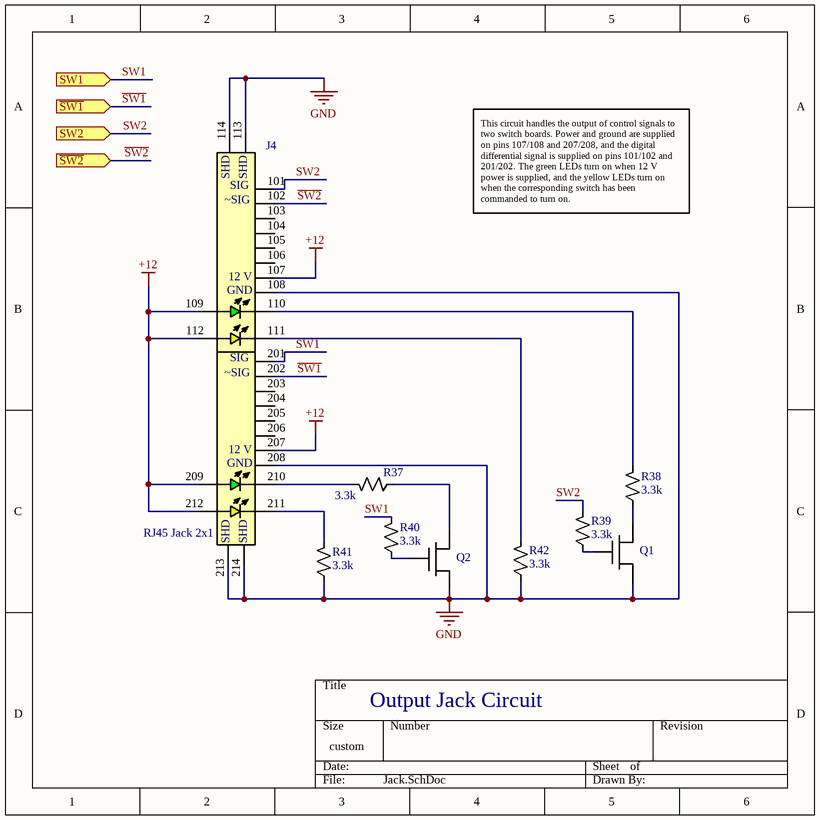
[diagram p6: Jack.SchDoc]

### Parts
J4  RJ45 Jack 2x1  [RJ45_JACK_STACKED]
Q1  Logic FET  [SOT23]  (value not drawn)
Q2  Logic FET  [SOT23]  (value not drawn)
R37  3.3k  [0603_RES]
R38  3.3k  [0603_RES]
R39  3.3k  [0603_RES]
R40  3.3k  [0603_RES]
R41  3.3k  [0603_RES]
R42  3.3k  [0603_RES]

### Ports
SW1 (in, see Jacks[3A]), SW2 (in, see Jacks[3A]), ~{SW1} (in, see Jacks[3A]), ~{SW2} (in, see Jacks[3A])

### Nets
+12: J4.107(12_V) J4.109 J4.112 J4.207(12_V) J4.209 J4.212
GND: J4.108(GND) J4.113(SHD1) J4.114(SHD2) J4.208(GND) J4.213(SHD1) J4.214(SHD2) Q1.3(S) Q2.3(S) R41.1 R42.1
~{SW1}: J4.202(Sig2) ; port ~{SW1}
~{SW2}: J4.102(Sig2) ; port ~{SW2}
SW1: J4.201(Sig1) R40.2 ; port SW1
SW2: J4.101(Sig1) R39.2 ; port SW2
NetJ4_110: J4.110 R38.2
NetJ4_111: J4.111 R42.2
NetJ4_210: J4.210 R37.2
NetJ4_211: J4.211 R41.2
NetQ1_1: Q1.1(D) R38.1
NetQ1_2: Q1.2(G) R39.1
NetQ2_1: Q2.1(D) R37.1
NetQ2_2: Q2.2(G) R40.1

Not connected (* = marked no-connect by the designer): J4 103(NC) 104(NC) 105(NC) 106(NC) 203(NC) 204(NC) 205(NC) 206(NC)

### Channels
JACKS/JACK1: designators end in _JACK1; ports SW1=12V_SW1 SW2=12V_SW2 ~{SW1}=~{12V_SW1} ~{SW2}=~{12V_SW2}
JACKS/JACK2: designators end in _JACK2; ports SW1=12V_SW3 SW2=12V_SW4 ~{SW1}=~{12V_SW3} ~{SW2}=~{12V_SW4}
JACKS/JACK3: designators end in _JACK3; ports SW1=12V_SW5 SW2=12V_SW6 ~{SW1}=~{12V_SW5} ~{SW2}=~{12V_SW6}
JACKS/JACK4: designators end in _JACK4; ports SW1=12V_SW1 SW2=12V_SW2 ~{SW1}=~{12V_SW1} ~{SW2}=~{12V_SW2}
JACKS/JACK5: designators end in _JACK5; ports SW1=12V_SW3 SW2=12V_SW10 ~{SW1}=~{12V_SW3} ~{SW2}=~{12V_SW10}
JACKS/JACK6: designators end in _JACK6; ports SW1=12V_SW11 SW2=12V_SW12 ~{SW1}=~{12V_SW11} ~{SW2}=~{12V_SW12}
JACKS/JACK7: designators end in _JACK7; ports SW1=12V_SW1 SW2=12V_SW14 ~{SW1}=~{12V_SW1} ~{SW2}=~{12V_SW14}
JACKS/JACK8: designators end in _JACK8; ports SW1=12V_SW15 SW2=12V_SW16 ~{SW1}=~{12V_SW15} ~{SW2}=~{12V_SW16}
JACKS/JACK9: designators end in _JACK9; ports SW1=12V_SW17 SW2=12V_SW18 ~{SW1}=~{12V_SW17} ~{SW2}=~{12V_SW18}

### Notes on the sheet
- This circuit handles the output of control signals to two switch boards. Power and ground are supplied on pins 107/108 and 207/208, and the digital differential signal is supplied on pins 101/102 and 201/202. The green LEDs turn on when 12 V power is supplied, and the yellow LEDs turn on when the corresponding switch has been commanded to turn on.
- Output Jack Circuit
- (in symbol J_RJ45_Jack_2x1_Stack) SHD; SIG; ~SIG

### Library data of the parts
J4 = J_RJ45_Jack_2x1_Stack: Jack RJ-45 8-pin 2x1 Stack
Q1 Q2 = Q_NFET: N-Channel Logic FET SOT23-3
R37-R42 = R_3300Ohm_0603_1%: Resistor 3.3 kOhm 0603 1%

## Nets that join several sheets
+3V3: Load_Bank_Master (33 pins), TX/TX_GROUP1 (6 pins), TX/TX_GROUP2 (6 pins), TX/TX_GROUP3 (6 pins), MUX1 (S1_MUX1.3), MUX2 (S1_MUX2.3), MUX3 (S1_MUX3.3), MUX4 (S1_MUX4.3), MUX5 (S1_MUX5.3), MUX6 (S1_MUX6.3), MUX7 (S1_MUX7.3), MUX8 (S1_MUX8.3), MUX9 (S1_MUX9.3), MUX10 (S1_MUX10.3), MUX11 (S1_MUX11.3), MUX12 (S1_MUX12.3), MUX13 (S1_MUX13.3), MUX14 (S1_MUX14.3), MUX15 (S1_MUX15.3), MUX16 (S1_MUX16.3), MUX17 (S1_MUX17.3), MUX18 (S1_MUX18.3)
+5: Load_Bank_Master (7 pins), SENSE1 (J3_SENSE1.7 J3_SENSE1.12), SENSE2 (J3_SENSE2.7 J3_SENSE2.12), SENSE3 (J3_SENSE3.7 J3_SENSE3.12)
+12: Load_Bank_Master (10 pins), TX/TX_GROUP1 (C25_TX_GROUP1.2 C28_TX_GROUP1.2 U6_TX_GROUP1.16 U8_TX_GROUP1.16), TX/TX_GROUP2 (C25_TX_GROUP2.2 C28_TX_GROUP2.2 U6_TX_GROUP2.16 U8_TX_GROUP2.16), TX/TX_GROUP3 (C25_TX_GROUP3.2 C28_TX_GROUP3.2 U6_TX_GROUP3.16 U8_TX_GROUP3.16), JACKS/JACK1 (6 pins), JACKS/JACK2 (6 pins), JACKS/JACK3 (6 pins), JACKS/JACK4 (6 pins), JACKS/JACK5 (6 pins), JACKS/JACK6 (6 pins), JACKS/JACK7 (6 pins), JACKS/JACK8 (6 pins), JACKS/JACK9 (6 pins)
GND: Load_Bank_Master (58 pins), SENSE1 (6 pins), SENSE2 (6 pins), SENSE3 (6 pins), TX/TX_GROUP1 (10 pins), TX/TX_GROUP2 (10 pins), TX/TX_GROUP3 (10 pins), MUX1 (S1_MUX1.1), MUX2 (S1_MUX2.1), MUX3 (S1_MUX3.1), MUX4 (S1_MUX4.1), MUX5 (S1_MUX5.1), MUX6 (S1_MUX6.1), MUX7 (S1_MUX7.1), MUX8 (S1_MUX8.1), MUX9 (S1_MUX9.1), MUX10 (S1_MUX10.1), MUX11 (S1_MUX11.1), MUX12 (S1_MUX12.1), MUX13 (S1_MUX13.1), MUX14 (S1_MUX14.1), MUX15 (S1_MUX15.1), MUX16 (S1_MUX16.1), MUX17 (S1_MUX17.1), MUX18 (S1_MUX18.1), JACKS/JACK1 (10 pins), JACKS/JACK2 (10 pins), JACKS/JACK3 (10 pins), JACKS/JACK4 (10 pins), JACKS/JACK5 (10 pins), JACKS/JACK6 (10 pins), JACKS/JACK7 (10 pins), JACKS/JACK8 (10 pins), JACKS/JACK9 (10 pins)
3V3_MC_SW1: Load_Bank_Master (U2.38), MUX1 (R36_MUX1.1)
3V3_MC_SW2: Load_Bank_Master (U2.33), MUX2 (R36_MUX2.1)
3V3_MC_SW3: Load_Bank_Master (U2.26), MUX3 (R36_MUX3.1)
3V3_MC_SW4: Load_Bank_Master (U2.25), MUX4 (R36_MUX4.1)
3V3_MC_SW5: Load_Bank_Master (U2.24), MUX5 (R36_MUX5.1)
3V3_MC_SW6: Load_Bank_Master (U2.23), MUX6 (R36_MUX6.1)
3V3_MC_SW7: Load_Bank_Master (U2.21), MUX7 (R36_MUX7.1)
3V3_MC_SW8: Load_Bank_Master (U2.20), MUX8 (R36_MUX8.1)
3V3_MC_SW9: Load_Bank_Master (U2.6), MUX9 (R36_MUX9.1)
3V3_MC_SW10: Load_Bank_Master (U2.5), MUX10 (R36_MUX10.1)
3V3_MC_SW11: Load_Bank_Master (U2.4), MUX11 (R36_MUX11.1)
3V3_MC_SW12: Load_Bank_Master (U2.2), MUX12 (R36_MUX12.1)
3V3_MC_SW13: Load_Bank_Master (U2.1), MUX13 (R36_MUX13.1)
3V3_MC_SW14: Load_Bank_Master (U2.48), MUX14 (R36_MUX14.1)
3V3_MC_SW15: Load_Bank_Master (U2.47), MUX15 (R36_MUX15.1)
3V3_MC_SW16: Load_Bank_Master (U2.43), MUX16 (R36_MUX16.1)
3V3_MC_SW17: Load_Bank_Master (U2.40), MUX17 (R36_MUX17.1)
3V3_MC_SW18: Load_Bank_Master (U2.39), MUX18 (R36_MUX18.1)
3V3_SW1: TX/TX_GROUP1 (U7_TX_GROUP1.5 U8_TX_GROUP1.3), MUX1 (R36_MUX1.2 S1_MUX1.2)
3V3_SW1: TX/TX_GROUP2 (U7_TX_GROUP2.5 U8_TX_GROUP2.3), MUX7 (R36_MUX7.2 S1_MUX7.2)
3V3_SW1: TX/TX_GROUP3 (U7_TX_GROUP3.5 U8_TX_GROUP3.3), MUX13 (R36_MUX13.2 S1_MUX13.2)
3V3_SW2: TX/TX_GROUP1 (U7_TX_GROUP1.3 U8_TX_GROUP1.9), MUX2 (R36_MUX2.2 S1_MUX2.2)
3V3_SW2: TX/TX_GROUP2 (U7_TX_GROUP2.3 U8_TX_GROUP2.9), MUX8 (R36_MUX8.2 S1_MUX8.2)
3V3_SW3: TX/TX_GROUP1 (U7_TX_GROUP1.1 U8_TX_GROUP1.11), MUX3 (R36_MUX3.2 S1_MUX3.2)
3V3_SW3: TX/TX_GROUP2 (U7_TX_GROUP2.1 U8_TX_GROUP2.11), MUX9 (R36_MUX9.2 S1_MUX9.2)
3V3_SW4: TX/TX_GROUP1 (U6_TX_GROUP1.11 U7_TX_GROUP1.13), MUX4 (R36_MUX4.2 S1_MUX4.2)
3V3_SW5: TX/TX_GROUP1 (U6_TX_GROUP1.14 U7_TX_GROUP1.9), MUX5 (R36_MUX5.2 S1_MUX5.2)
3V3_SW6: TX/TX_GROUP1 (U6_TX_GROUP1.7 U7_TX_GROUP1.11), MUX6 (R36_MUX6.2 S1_MUX6.2)
3V3_SW10: TX/TX_GROUP2 (U6_TX_GROUP2.11 U7_TX_GROUP2.13), MUX10 (R36_MUX10.2 S1_MUX10.2)
3V3_SW11: TX/TX_GROUP2 (U6_TX_GROUP2.14 U7_TX_GROUP2.9), MUX11 (R36_MUX11.2 S1_MUX11.2)
3V3_SW12: TX/TX_GROUP2 (U6_TX_GROUP2.7 U7_TX_GROUP2.11), MUX12 (R36_MUX12.2 S1_MUX12.2)
3V3_SW14: TX/TX_GROUP3 (U7_TX_GROUP3.3 U8_TX_GROUP3.9), MUX14 (R36_MUX14.2 S1_MUX14.2)
3V3_SW15: TX/TX_GROUP3 (U7_TX_GROUP3.1 U8_TX_GROUP3.11), MUX15 (R36_MUX15.2 S1_MUX15.2)
3V3_SW16: TX/TX_GROUP3 (U6_TX_GROUP3.11 U7_TX_GROUP3.13), MUX16 (R36_MUX16.2 S1_MUX16.2)
3V3_SW17: TX/TX_GROUP3 (U6_TX_GROUP3.14 U7_TX_GROUP3.9), MUX17 (R36_MUX17.2 S1_MUX17.2)
3V3_SW18: TX/TX_GROUP3 (U6_TX_GROUP3.7 U7_TX_GROUP3.11), MUX18 (R36_MUX18.2 S1_MUX18.2)
12V_SW1: TX/TX_GROUP1 (U8_TX_GROUP1.2), JACKS/JACK1 (J4_JACK1.201 R40_JACK1.2)
12V_SW1: TX/TX_GROUP2 (U8_TX_GROUP2.2), JACKS/JACK4 (J4_JACK4.201 R40_JACK4.2)
12V_SW1: TX/TX_GROUP3 (U8_TX_GROUP3.2), JACKS/JACK7 (J4_JACK7.201 R40_JACK7.2)
12V_SW2: TX/TX_GROUP1 (U8_TX_GROUP1.10), JACKS/JACK1 (J4_JACK1.101 R39_JACK1.2)
12V_SW2: TX/TX_GROUP2 (U8_TX_GROUP2.10), JACKS/JACK4 (J4_JACK4.101 R39_JACK4.2)
12V_SW3: TX/TX_GROUP1 (U8_TX_GROUP1.12), JACKS/JACK2 (J4_JACK2.201 R40_JACK2.2)
12V_SW3: TX/TX_GROUP2 (U8_TX_GROUP2.12), JACKS/JACK5 (J4_JACK5.201 R40_JACK5.2)
12V_SW4: TX/TX_GROUP1 (U6_TX_GROUP1.12), JACKS/JACK2 (J4_JACK2.101 R39_JACK2.2)
12V_SW5: TX/TX_GROUP1 (U6_TX_GROUP1.15), JACKS/JACK3 (J4_JACK3.201 R40_JACK3.2)
12V_SW6: TX/TX_GROUP1 (U6_TX_GROUP1.6), JACKS/JACK3 (J4_JACK3.101 R39_JACK3.2)
12V_SW10: TX/TX_GROUP2 (U6_TX_GROUP2.12), JACKS/JACK5 (J4_JACK5.101 R39_JACK5.2)
12V_SW11: TX/TX_GROUP2 (U6_TX_GROUP2.15), JACKS/JACK6 (J4_JACK6.201 R40_JACK6.2)
12V_SW12: TX/TX_GROUP2 (U6_TX_GROUP2.6), JACKS/JACK6 (J4_JACK6.101 R39_JACK6.2)
12V_SW14: TX/TX_GROUP3 (U8_TX_GROUP3.10), JACKS/JACK7 (J4_JACK7.101 R39_JACK7.2)
12V_SW15: TX/TX_GROUP3 (U8_TX_GROUP3.12), JACKS/JACK8 (J4_JACK8.201 R40_JACK8.2)
12V_SW16: TX/TX_GROUP3 (U6_TX_GROUP3.12), JACKS/JACK8 (J4_JACK8.101 R39_JACK8.2)
12V_SW17: TX/TX_GROUP3 (U6_TX_GROUP3.15), JACKS/JACK9 (J4_JACK9.201 R40_JACK9.2)
12V_SW18: TX/TX_GROUP3 (U6_TX_GROUP3.6), JACKS/JACK9 (J4_JACK9.101 R39_JACK9.2)
~{12V_SW1}: TX/TX_GROUP1 (U8_TX_GROUP1.4), JACKS/JACK1 (J4_JACK1.202)
~{12V_SW1}: TX/TX_GROUP2 (U8_TX_GROUP2.4), JACKS/JACK4 (J4_JACK4.202)
~{12V_SW1}: TX/TX_GROUP3 (U8_TX_GROUP3.4), JACKS/JACK7 (J4_JACK7.202)
~{12V_SW2}: TX/TX_GROUP1 (U8_TX_GROUP1.6), JACKS/JACK1 (J4_JACK1.102)
~{12V_SW2}: TX/TX_GROUP2 (U8_TX_GROUP2.6), JACKS/JACK4 (J4_JACK4.102)
~{12V_SW3}: TX/TX_GROUP1 (U8_TX_GROUP1.15), JACKS/JACK2 (J4_JACK2.202)
~{12V_SW3}: TX/TX_GROUP2 (U8_TX_GROUP2.15), JACKS/JACK5 (J4_JACK5.202)
~{12V_SW4}: TX/TX_GROUP1 (U6_TX_GROUP1.10), JACKS/JACK2 (J4_JACK2.102)
~{12V_SW5}: TX/TX_GROUP1 (U6_TX_GROUP1.2), JACKS/JACK3 (J4_JACK3.202)
~{12V_SW6}: TX/TX_GROUP1 (U6_TX_GROUP1.4), JACKS/JACK3 (J4_JACK3.102)
~{12V_SW10}: TX/TX_GROUP2 (U6_TX_GROUP2.10), JACKS/JACK5 (J4_JACK5.102)
~{12V_SW11}: TX/TX_GROUP2 (U6_TX_GROUP2.2), JACKS/JACK6 (J4_JACK6.202)
~{12V_SW12}: TX/TX_GROUP2 (U6_TX_GROUP2.4), JACKS/JACK6 (J4_JACK6.102)
~{12V_SW14}: TX/TX_GROUP3 (U8_TX_GROUP3.6), JACKS/JACK7 (J4_JACK7.102)
~{12V_SW15}: TX/TX_GROUP3 (U8_TX_GROUP3.15), JACKS/JACK8 (J4_JACK8.202)
~{12V_SW16}: TX/TX_GROUP3 (U6_TX_GROUP3.10), JACKS/JACK8 (J4_JACK8.102)
~{12V_SW17}: TX/TX_GROUP3 (U6_TX_GROUP3.2), JACKS/JACK9 (J4_JACK9.202)
~{12V_SW18}: TX/TX_GROUP3 (U6_TX_GROUP3.4), JACKS/JACK9 (J4_JACK9.102)
I_SENSE_1: Load_Bank_Master (U2.7), SENSE1 (C23_SENSE1.2 R33_SENSE1.2 R34_SENSE1.2)
I_SENSE_2: Load_Bank_Master (U2.15), SENSE2 (C23_SENSE2.2 R33_SENSE2.2 R34_SENSE2.2)
I_SENSE_3: Load_Bank_Master (U2.16), SENSE3 (C23_SENSE3.2 R33_SENSE3.2 R34_SENSE3.2)
VREF: Load_Bank_Master (C21.2 R22.1 U5.5), SENSE1 (J3_SENSE1.2), SENSE2 (J3_SENSE2.2), SENSE3 (J3_SENSE3.2)